# Altium project Floyd-V2.PrjPcb
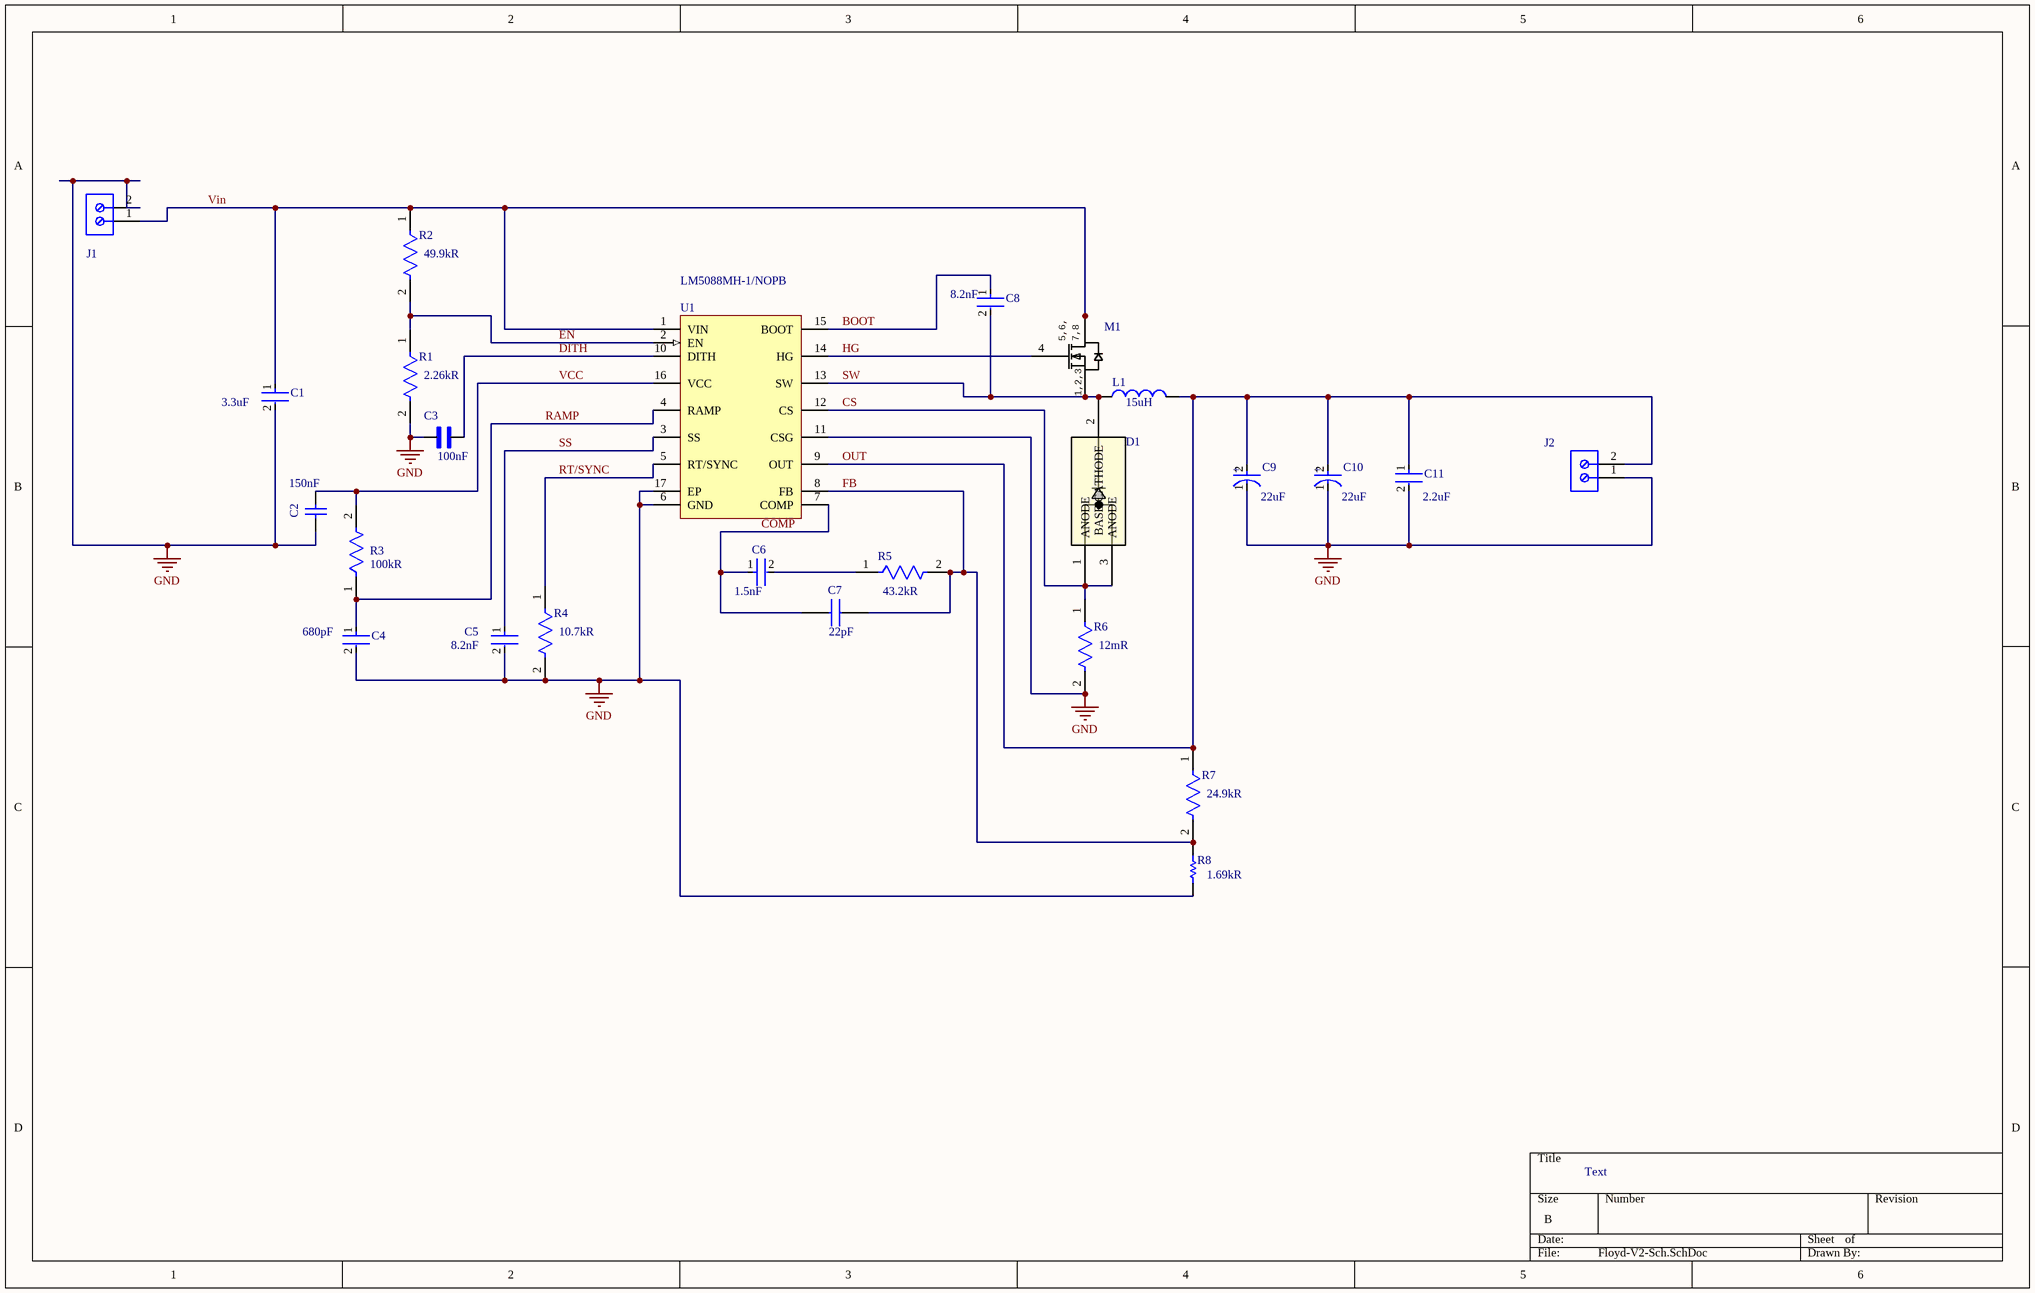
[diagram p0: Floyd-V2-Sch.SchDoc]
1 sheet, 25 parts. Net scope: global (net labels, ports and power ports of the same name join across sheets).
Board file: Floyd-V2-PCB.PcbDoc

## Sheet Floyd-V2-Sch.SchDoc
size B; SheetNumber: 1; SheetTotal: 1

### Parts
C1  Capacitance: 3.3uF  [FP-C3225-200-0_4-IPC_A]  (hidden comment: C3225X7S2A335K200AB)
C2  Parameter 1: 150nF  [CAPC2013X140X50LL20T25]  (hidden comment: 08053C154KAT2A)
C3  value 100nF  [CAPC2012X94N]  (hidden comment: 08053C104JAZ2A)
C4  Capacitance: 680pF  [FP-CC0805-0_1-0_7-MFG]  (hidden comment: CC0805JRNPO9BN681)
C5  Capacitance: 8.2nF  [FP-CGA4J-IPC_A]  (hidden comment: CGA4C2C0G1H822J060AA)
C6  Capacitance: 1.5nF  [FP-C0603C-CF-MFG]  (hidden comment: C0603C152K5RACTU)
C7  Parameter 1: 22pF  [CAPC1608X90N]  (hidden comment: CL10C220JB8NNNC)
C8  Capacitance: 8.2nF  [FP-CGA4J-IPC_A]  (hidden comment: CGA4C2C0G1H822J060AA)
C9  Capacitance: 22uF  [FP-OS-CON-SMT-C6-MFG]  (hidden comment: 35SVPF22M)
C10  Capacitance: 22uF  [FP-OS-CON-SMT-C6-MFG]  (hidden comment: 35SVPF22M)
C11  Capacitance: 2.2uF  [FP-C2012-125-0_2-IPC_A]  (hidden comment: C2012X5R1E225K125AC)
D1  SBRD10200TR  [DPAK_SBRD10200_6P6X6P1_SDS]  (value not drawn)
J1  691137710002  [691137710002]  (value not drawn)
J2  691137710002  [691137710002]  (value not drawn)
L1  value 15uH  [IND_MSS1210-153MEB]  (hidden comment: MSS1210-153MEB)
M1  CSD18543Q3A  [DNH0008A_NV]  (value not drawn)
R1  Resistance: 2.26kR  [FP-CRCW0805-e3-IPC_C]  (hidden comment: CRCW08052K26FKEA)
R2  Resistance: 49.9kR  [FP-CRCW0805-e3-IPC_C]  (hidden comment: CRCW080549K9FKEA)
R3  Resistance: 100kR  [FP-CRCW0805-e3-MFG]  (hidden comment: CRCW0805100KFKEA)
R4  Resistance: 10.7kR  [FP-CRCW0805-e3-IPC_C]  (hidden comment: CRCW080510K7FKEA)
R5  Resistance: 43.2kR  [FP-CRCW0603-e3-MFG]  (hidden comment: CRCW060343K2FKEA)
R6  Resistance: 12mR  [FP-CSR1206-IPC_B]  (hidden comment: CSR1206FK12L0)
R7  Resistance: 24.9kR  [FP-CRCW0402-e3-IPC_C]  (hidden comment: CRCW040224K9FKED)
R8  Parameter 1: 1.69kR  [RESC1609X50X30ML10T20]  (hidden comment: CRCW06031K69FKEA)
U1  LM5088MH-1/NOPB  [MXA16A]

### Nets
GND: C1.2 C2.1 C3.1 C4.2 C5.2 C9.1(C) C10.1(C) C11.2 J1.2 J2.1 R1.2 R4.2 R6.2 R8.1 U1.6(GND) U1.11(CSG) U1.17(EP)
BOOT: C8.1 U1.15(BOOT)
COMP: C6.1 C7.1 U1.7(COMP)
CS: D1.1(ANODE) D1.3(ANODE) R6.1 U1.12(CS)
DITH: C3.2 U1.10(DITH)
EN: R1.1 R2.2 U1.2(EN)
FB: C7.2 R5.2 R7.2 R8.2 U1.8(FB)
HG: M1.4(G) U1.14(HG)
OUT: C9.2(A) C10.2(A) C11.1 J2.2 L1.2 R7.1 U1.9(OUT)
RAMP: C4.1 R3.1 U1.4(RAMP)
RT/SYNC: R4.1 U1.5(RT/SYNC)
SS: C5.1 U1.3(SS)
SW: C8.2 D1.2(BASE_CATHODE) L1.1 M1.1(S) M1.2(S) M1.3(S) U1.13(SW)
VCC: C2.2 R3.2 U1.16(VCC)
Vin: C1.1 J1.1 M1.5(D) M1.6(D) M1.7(D) M1.8(D) M1.9(D) R2.1 U1.1(VIN)
NetC6_2: C6.2 R5.1

### Notes on the sheet
- Text
- (in symbol CMP-05428-000019-2) +
- (in symbol CSD18543Q3A) 5,6,; 7,8; 1,2,3

### Library data of the parts
C1 = CMP-08246-004991-1: Multilayer Ceramic Capacitors 3.3uF ±10% 100V X7S SMD 1210; Series: C; Depth: 2.5mm; Dielectric: X7S; Case Code (Imperial): 1210; Number of Pins: 2; Thickness: 0.087inch; RoHS Compliant: Yes; Voltage Rating (DC): 100V; Voltage Rating: 100V; Length: 0.126inch; REACH SVHC: No SVHC; Height: 2.5mm; Width: 0.098inch; Lead Free: Lead Free; Package Quantity: 1; Tolerance: 10%; Max Operating Temperature: 125°C; Termination: SMD/SMT; Mount: Surface Mount; Case/Package: 1210; Case Code (Metric): 3225; Packaging: Tape and Reel; Weight: 0.000564oz; Resistor Type: Ceramic; Min Operating Temperature: -55°C; ComponentLink1Description: New link; ComponentLink1URL: *; Parameter 1: *
C2 = CMP-1036-04480-3: Manufacturer: AVX Interconnect / Elco; Part Number: 08053C154KAT2A
C3 = 08053C104JAZ2A: 0.1 ÂµF Â±5% 25V Ceramic Capacitor X7R 0805 (2012 Metric); MF: AVX; SnapEDA_Link: https://www.snapeda.com/parts/08053C104JAZ2A/AVX/view-part/?ref=snap; Package: 2012 AVX; MP: 08053C104JAZ2A; Check_prices: https://www.snapeda.com/parts/08053C104JAZ2A/AVX/view-part/?ref=eda
C4 = CMP-03422-001404-1: CAP CER 680PF 50V C0G/NPO 0805; Tolerance: 5%; Dielectric: C0G; Temperature Coefficient: 30ppm/°C; Material: Ceramic; Insulation Resistance: 100GR; Packaging: Tape and Reel; Voltage Rating (DC): 50V; Mount: Surface Mount; Case Code (Imperial): 0805; Width: 1.25mm; Termination: SMD/SMT; Depth: 1.25mm; Case/Package: 0805; Case Code (Metric): 2012; Voltage Rating: 50V; Number of Pins: 2; Radiation Hardening: No; Thickness: 0.024inch; Series: CC; Resistor Type: Ceramic; Package Quantity: 1; Height: 0.6mm; Min Operating Temperature: -55°C; Max Operating Temperature: 125°C; Lead Free: Lead Free; Length: 2mm; RoHS Compliant: Yes; Voltage: 50V; REACH SVHC: No SVHC
C5 C8 = CMP-08246-000542-1: Cap Ceramic 8.2nF 50V C0G 5% Pad SMD 0805 +125°C Automotive T/R; Case/Package: 0805; Package Quantity: 1; Weight: 0.000194oz; Voltage Rating (DC): 50V; Composition: Ceramic; Min Operating Temperature: -55°C; Case Code (Metric): 2012; Length: 2mm; Packaging: Tape and Reel; Height: 0.6mm; REACH SVHC: No SVHC; Case Code (Imperial): 0805; Mount: Surface Mount; Voltage Rating: 50V; Dielectric: C0G; Max Operating Temperature: 125°C; Width: 0.049inch; Depth: 1.25mm; Tolerance: 5%; Termination: SMD/SMT; Thickness: 0.028inch; Ratings: AEC-Q200
C6 = CMP-2006-03093-2: CAP CER 1500PF 50V X7R 0603; Manufacturer: KEMET; Material: Ceramic; Tolerance: 0.1; Value: 1,500 pF; Temperature Coefficient: 30ppm/°C; Automotive Grade: Grade 1; Height: 0.87mm; Digikey Description: CAP CER 1500PF 50V X7R 0603; Category: Cap; Automotive: Yes; ComponentLink2URL: https://api.kemet.com/component-edge/download/datasheet/C0603C100J5GACAUTO.pdf; Temperature Range High: +125°C; Device Class L2: Capacitors; Voltage Rating: 50 V; ComponentLink2Description: Datasheet; Mouser Description: Multilayer Ceramic Capacitors MLCC - SMD/SMT 50volts 1500pF X7R 10%; Octopart: https://octopart.com/c0603c152k5ractu-kemet-137039; Temperature Characteristic: X7R; Device Class L1: Passive Components; Package: C0603C-CF; Temperature: -55°C to +125°C; RoHS: TRUE; Temperature Range Low: -55°C; Device Class L3: Ceramic Capacitors; Manufacturer Part Number: C0603C152K5RACTU; Lead Free: Yes
C7 = CL10C220JB8NNNC: Samsung Electro-Mechanics CL10C220JB8NNNC 22pF Multilayer Ceramic Capacitor MLCC 50V dc +/-5% Tolerance SMD; Geometry.Height: 0.9mm; Mouser Part Number: 187-CL10C220JB8NNNC; Mouser Price/Stock: https://www.mouser.co.uk/ProductDetail/Samsung-Electro-Mechanics/CL10C220JB8NNNC?qs=349EhDEZ59oibjgB6q8fqA%3D%3D; Manufacturer_Name: SAMSUNG; Manufacturer_Part_Number: CL10C220JB8NNNC; Datasheet Link: https://www.arrow.com/en/products/cl10c220jb8nnnc/samsung-electro-mechanics
C9 C10 = CMP-05428-000019-2: Conductive Polymer Aluminum Solid Capacitors (OS-CON) 22uF ±20% 35V; Ripple Current (AC): 2.6A; ESR (Equivalent Series Resistance): 35mR; Leakage Current: 154uA; Life (Hours): 5000Hour; Polarity: Polar; Dissipation Factor: 12%; RoHS Compliant: Yes; Voltage Rating: 35V; Tolerance: 20%; Case/Package: Radial; Diameter: 6.3mm; Series: OS-CON™, SVPF; Packaging: Tape and Reel; Number of Pins: 6; Max Operating Temperature: 105°C; Voltage Rating (DC): 35V; Ripple Current: 2.6A; REACH SVHC: No SVHC; Voltage: 35V; Min Operating Temperature: -55°C; Mount: Surface Mount; Termination: SMD/SMT; Height: 5.9mm; Length: 5.9mm; Package Quantity: 1000; Height - Seated (Max): 0.236inch
C11 = CMP-08246-006459-1: Multilayer Ceramic Capacitors 2.2μF ±10% 25V X5R SMD 0805; Package Quantity: 1; RoHS Compliant: Yes; Mount: Surface Mount; Voltage Rating: 25V; Case Code (Metric): 2012; Number of Pins: 2; Min Operating Temperature: -55°C; Max Operating Temperature: 85°C; Weight: 0.000194oz; Lead Free: Lead Free; Tolerance: 10%; Case Code (Imperial): 0805; Packaging: Tape and Reel; Depth: 1.25mm; REACH SVHC: No SVHC; Resistor Type: Ceramic; Height: 1.25mm; Dielectric: X5R; Length: 2mm; Thickness: 0.057inch; Width: 0.049inch; Voltage Rating (DC): 25V; Case/Package: 0805; Dielectric Material: Ceramic; Termination: SMD/SMT; Construction: Flat; Series: C
D1 = SBRD10200TR: Description; Manufacturer_Name: SMC Diode Solutions; Copyright: Copyright (C) 2025 Ultra Librarian. All rights reserved.; Manufacturer_Part_Number: SBRD10200TR; RefDes: RefDes; Type: Type
J1 J2 = 691137710002: WR-TBL Series 1377 Horizontal Entry, THT, pitch 5mm, 02p; Manufacturer: Wurth Elektronik; Modularity: No; Rated Current: 16A; System: Wire Protector; Working Voltage: 300V; Manufacturer Part Number: 691137710002; Category: Terminal Block; Match Code: WR-TBL; ComponentLink1Description: Website Link; ComponentLink1URL: https://www.we-online.com/redexpert/article/691137710002?ad; ComponentLink2Description: Datasheet Link; ComponentLink2URL: https://www.we-online.com/redexpert/spec/691137710002?ad; Mount: Through Hole; Min Operating Temperature: -30°C; Max Operating Temperature: 120°C; Packaging: Box; Application: Pressure Clamp; Number of Pins: 2; Number of Rows: 1; Orientation: Horizontal; Pitch: 5mm
L1 = MSS1210-153MEB: Power inductor, shielded, 10/20% tol, SMT, RoHS; MF: Coilcraft; Package: None; Price: None; MP: MSS1210-153MEB; SnapEDA_Link: https://www.snapeda.com/parts/MSS1210-153MEB/Coilcraft/view-part/681728/?ref=snap; Availability: Unavailable
M1 = CSD18543Q3A: 60-V, N channel NexFETâ„¢ power MOSFET, single SON 3 mm x 3 mm, 9.9 mOhm 8-VSONP -55 to 150; Manufacturer_Name: Texas Instruments; VALUE_2: Value; TYPE: TYPE; RefDes: RefDes; Copyright: Copyright (C) 2026 Ultra Librarian. All rights reserved.; Manufacturer_Part_Number: CSD18543Q3A
R1 = CMP-2001-03765-2: RES Thick Film, 2.26kΩ, 1%, 0.125W, 100ppm/°C, 0805; Voltage Rating (DC): 150V; Power Rating: 125mW; Width: 0.049inch; Temperature Coefficient: 100ppm/°C; Weight: 0.000194oz; Contact Plating: Tin; Case/Package: 0805; Max Operating Temperature: 155°C; Package Quantity: 10; Length: 2mm; Tolerance: 1%; Number of Terminations: 2; Radiation Hardening: No; Lead Free: Lead Free; Composition: Thick Film; Case Code (Metric): 2012; Military Standard: Not; Max Power Dissipation: 125mW; Termination: Solder; Case Code (Imperial): 0805; Voltage Rating: 150V; Height: 0.02inch; Packaging: Tape and Reel; Min Operating Temperature: -55°C; Features: Automotive AEC-Q200; Depth: 1.25mm; Parameter 1: *
R2 = CMP-2001-03952-2: RES Thick Film, 49.9kΩ, 1%, 0.125W, 100ppm/°C, 0805; Power Rating: 125mW; Voltage Rating (DC): 150V; Contact Plating: Tin; Case Code (Imperial): 0805; Package Quantity: 10; Termination: SMD/SMT; Length: 2mm; Width: 0.049inch; Case Code (Metric): 2012; Temperature Coefficient: 100ppm/°C; Tolerance: 1%; Depth: 1.25mm; Mount: Surface Mount; Lead Free: Lead Free; Min Operating Temperature: -55°C; Case/Package: 0805; Number of Terminations: 2; Composition: Thick Film; Height: 0.45mm; Voltage Rating: 150V; Max Power Dissipation: 125mW; Features: Automotive AEC-Q200; Military Standard: Not; Radiation Hardening: No; Max Operating Temperature: 155°C; Weight: 0.000194oz; Packaging: Tape and Reel
R3 = CMP-2001-04899-2: RES Thick Film, 100kΩ, 1%, 0.125W, 100ppm/°C, 0805; Power Rating: 125mW; Voltage Rating: 150V; Case/Package: 0805; Max Operating Temperature: 155°C; Case Code (Imperial): 0805; Lead Free: Lead Free; Weight: 0.000194oz; Number of Pins: 2; Package Quantity: 5000; Height: 0.45mm; Composition: Thick Film; Military Standard: Not; Tolerance: 1%; Case Code (Metric): 2012; Termination: SMD/SMT; Mount: Surface Mount; Radiation Hardening: No; Width: 1.25mm; Length: 2mm; Depth: 1.25mm; Packaging: Tape and Reel; Min Operating Temperature: -55°C; Contact Plating: Tin; Temperature Coefficient: 100ppm/°C; Voltage Rating (DC): 150V
R4 = CMP-2001-04284-2: RES Thick Film, 10.7kΩ, 1%, 0.125W, 100ppm/°C, 0805; Voltage Rating: 150V; Max Power Dissipation: 125mW; Height: 0.02inch; Lead Free: Lead Free; Contact Plating: Tin; Tolerance: 1%; Composition: Thick Film; Min Operating Temperature: -55°C; Number of Pins: 2; Weight: 0.000194oz; Depth: 1.25mm; Military Standard: Not; Temperature Coefficient: 100ppm/°C; Case Code (Imperial): 0805; Packaging: Tape and Reel; Case Code (Metric): 2012; Case/Package: 0805; Termination: SMD/SMT; Length: 2mm; Features: Automotive AEC-Q200; Max Operating Temperature: 155°C; Voltage Rating (DC): 150V; Radiation Hardening: No; Package Quantity: 10; Width: 1.25mm; Number of Terminations: 2; Power Rating: 125mW
R5 = CMP-1012-00695-3: RES Thick Film, 43.2kΩ, 1%, 0.1W, 100ppm/°C, 0603; Power Rating: 100mW; Voltage Rating: 75V; Tolerance: 1%; Depth: 0.85mm; Width: 0.033inch; Radiation Hardening: No; Weight: 7.1E-05oz; Package Quantity: 10; Height: 0.45mm; Lead Free: Lead Free; Min Operating Temperature: -55°C; Case Code (Imperial): 0603; Composition: Thick Film; Case Code (Metric): 1608; Temperature Coefficient: 100ppm/°C; Case/Package: 0603; Number of Terminations: 2; Contact Plating: Tin; Military Standard: Not; Length: 1.55mm; Max Power Dissipation: 100mW; Features: Automotive AEC-Q200; Max Operating Temperature: 155°C; Number of Pins: 2; Termination: SMD/SMT; Packaging: Tape and Reel; Voltage Rating (DC): 75V
R6 = CMP-26527-002803-1: General Purpose Thick Film Chip Resistor, 1206, 12mΩ, 1%, 0.5W; Temperature Coefficient: 100ppm/°C; Max Power Dissipation: 500mW; Case/Package: 1206; Case Code (Imperial): 1206; Series: CSR; Max Operating Temperature: 155°C; Contact Plating: Tin; Min Operating Temperature: -55°C; Length: 0.12inch; Tolerance: 1%; Width: 0.061inch; Packaging: Tape and Reel; Military Standard: Not; Lead Free: Lead Free; Construction: Rectangular; Depth: 1.55mm; Mount: Surface Mount; RoHS Compliant: Yes; Case Code (Metric): 3216; Resistor Type: Thick Film; Number of Terminations: 2; Height: 0.026inch
R7 = CMP-2002-08407-2: RES Thick Film, 24.9kΩ, 1%, 0.063W, 100ppm/°C, 0402; Voltage Rating (DC): 50V; Power Rating: 63mW; Temperature Coefficient: 100ppm/°C; Case/Package: 0402; Length: 1mm; Radiation Hardening: No; Case Code (Imperial): 0402; Lead Free: Lead Free; Military Standard: Not; Composition: Thick Film; Tolerance: 1%; Min Operating Temperature: -55°C; Height: 0.35mm; Mount: Surface Mount; Max Operating Temperature: 155°C; Packaging: Tape and Reel; Case Code (Metric): 1005; Number of Terminations: 2; Contact Plating: Tin; Voltage Rating: 50V; Weight: 2.3E-05oz; Termination: SMD/SMT; Width: 0.5mm; Max Power Dissipation: 63mW; Number of Pins: 2; Features: Automotive AEC-Q200; Depth: 0.5mm; Package Quantity: 10
R8 = CMP-2000-03004-1: Manufacturer: Vishay Dale; Part Number: CRCW06031K69FKEA
U1 = PM-SWREG-LM5088-1-17: Wide Input Range Non-Synchronous Buck Controller, 16-pin TSSOP-EP, Pb-Free; Manufacturer: Texas Instruments; PowerWise: Y; CompType: Switcher; PackageTopMarking: NSUZXYTT*LM5088*MH-1; ComponentLink1Description: Datasheet URL; RoHS: Y; ComponentLink1URL: http://www.ti.com/general/docs/lit/getliterature.tsp?genericPartNumber=LM5088&fileType=pdf; PackageDescription: Molded TSSOP, Jedec, Exposed Pad, 5.0 x 4.4 x 0.9mm Body,16 Lead, 0.65mm Pitch; PinCount: 16; PackageReference: PWP0016A; Code_JEDEC: MO-153-ABT